# Altium schematic sheet Interface_RS232.SchDoc
size 127 x 58 mm
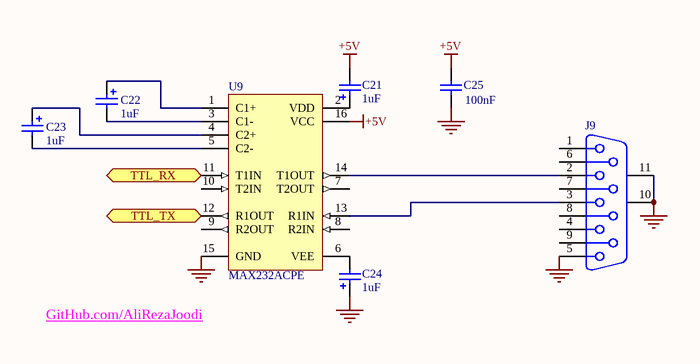
[diagram p0: Interface_RS232.SchDoc]

## Parts
C21  value 1uF  [CAPPR2.5-6.3x5]  (hidden comment: C18)
C22  value 1uF  [CAPPR2.5-6.3x5]  (hidden comment: C18)
C23  value 1uF  [CAPPR2.5-6.3x5]  (hidden comment: C18)
C24  value 1uF  [CAPPR2.5-6.3x5]  (hidden comment: C18)
C25  value 100nF  [CAPNTO2.54-3.05x1.78A]  (hidden comment: Cap)
J9  D Connector 9  [DSUB1.385-2H9]  (value not drawn)
U9  MAX232ACPE  [PE16A]

## Ports
TTL_RX (in), TTL_TX (out)

## Nets
+5V: C21.2 C25.1 U9.16(VCC)
GND: C24.1 C25.2 J9.5 J9.10(MH1) J9.11(MH2) U9.15(GND)
TTL_RX: U9.11(T1IN) ; port TTL_RX
TTL_TX: U9.12(R1OUT) ; port TTL_TX
NetC21_1: C21.1 U9.2(VDD)
NetC22_1: C22.1 U9.1(C1+)
NetC22_2: C22.2 U9.3(C1-)
NetC23_1: C23.1 U9.4(C2+)
NetC23_2: C23.2 U9.5(C2-)
NetC24_2: C24.2 U9.6(VEE)
NetJ9_2: J9.2 U9.14(T1OUT)
NetJ9_3: J9.3 U9.13(R1IN)

Not connected (* = marked no-connect by the designer): J9 1 4 6 7 8 9; U9 7(T2OUT) 8(R2IN) 9(R2OUT) 10(T2IN)

## Notes on the sheet
- (near U9) GitHub.com/AliRezaJoodi

## Library data of the parts
C21-C24 = Cap Pol1: Polarized Capacitor (Radial); Manufacturer: Generic Components; Class I: Passive; Published: 8-Jun-2000; Revision: July-2002: Re-released for DXP Platform.; Publisher: Altium Limited; Class II: Capacitor
C25 = Cap: Capacitor; Published: 8-Jun-2000; LatestRevisionDate: 17-Jul-2002; LatestRevisionNote: Re-released for DXP Platform.; PackageReference: RAD-0.3; Publisher: Altium Limited
J9 = D Connector 9: Receptacle Assembly, 9 Position, Right Angle; Manufacturer: Generic Components; Package Information: Latest Revision: O; Positions: 9; Published: 15-Jun-2001; Revision: July-2002: Re-released for DXP Platform.; Datasheet: (1-Sep-1999); Package Reference: 788750; Publisher: Altium Limited; Class I: Connector; Orientation: Right Angle; Gender: Receptacle
U9 = MAX232ACPE: +5V Powered, Multi-Channel RS-232 Driver/Receiver; Published: 16-Jan-2001; LatestRevisionDate: 29-May-2009; LatestRevisionNote: Component Body Added.; PackageVersion: 1997; PackageReference: PE16A; Publisher: Altium Limited; PackageDescription: DIP, 16-Pin, Row Spacing 7.62 mm, Pitch 2.54 mm; Code_JEDEC: MS-001-BB; ComponentLink1Description: Manufacturer Link; ComponentLink1URL: http://www.maxim-ic.com/; ComponentLink2Description: Datasheet; ComponentLink2URL: http://pdfserv.maxim-ic.com/en/ds/MAX220-MAX249.pdf